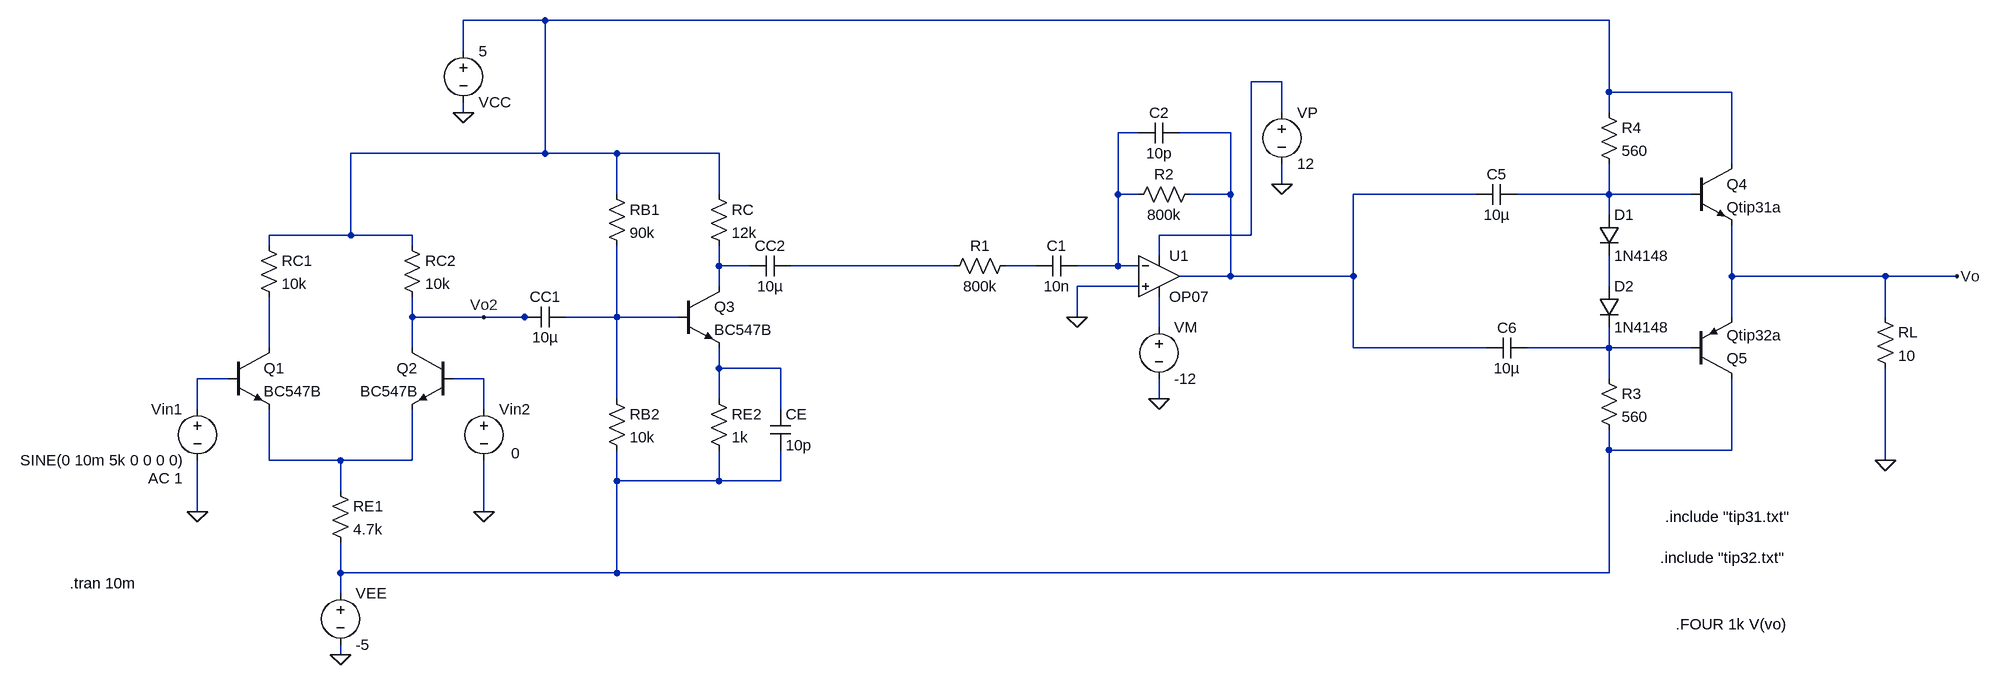
[diagram p0: schematic Complete Circuit.asc]
Complete Circuit.asc, the LTspice schematic file:
Version 4
SHEET 1 3528 680
WIRE 896 -544 768 -544
WIRE 2560 -544 896 -544
WIRE 768 -496 768 -544
WIRE 2048 -448 2000 -448
WIRE 2560 -432 2560 -544
WIRE 2752 -432 2560 -432
WIRE 768 -400 768 -416
WIRE 2048 -400 2048 -448
WIRE 2560 -400 2560 -432
WIRE 1824 -368 1792 -368
WIRE 1968 -368 1888 -368
WIRE 896 -336 896 -544
WIRE 896 -336 592 -336
WIRE 1008 -336 896 -336
WIRE 1168 -336 1008 -336
WIRE 2752 -320 2752 -432
WIRE 2048 -288 2048 -320
WIRE 1008 -272 1008 -336
WIRE 1168 -272 1168 -336
WIRE 1792 -272 1792 -368
WIRE 1824 -272 1792 -272
WIRE 1968 -272 1968 -368
WIRE 1968 -272 1904 -272
WIRE 2352 -272 2160 -272
WIRE 2560 -272 2560 -320
WIRE 2560 -272 2416 -272
WIRE 2688 -272 2560 -272
WIRE 2560 -240 2560 -272
WIRE 592 -208 592 -336
WIRE 592 -208 464 -208
WIRE 688 -208 592 -208
WIRE 2000 -208 2000 -448
WIRE 2000 -208 1856 -208
WIRE 464 -192 464 -208
WIRE 688 -192 688 -208
WIRE 1856 -176 1856 -208
WIRE 1168 -160 1168 -192
WIRE 1216 -160 1168 -160
WIRE 1536 -160 1280 -160
WIRE 1664 -160 1616 -160
WIRE 1792 -160 1792 -272
WIRE 1792 -160 1728 -160
WIRE 1824 -160 1792 -160
WIRE 1968 -144 1968 -272
WIRE 1968 -144 1888 -144
WIRE 2160 -144 2160 -272
WIRE 2160 -144 1968 -144
WIRE 2752 -144 2752 -224
WIRE 2992 -144 2752 -144
WIRE 3104 -144 2992 -144
WIRE 1168 -128 1168 -160
WIRE 1824 -128 1728 -128
WIRE 2560 -128 2560 -176
WIRE 688 -80 688 -112
WIRE 800 -80 688 -80
WIRE 864 -80 800 -80
WIRE 880 -80 864 -80
WIRE 1008 -80 1008 -192
WIRE 1008 -80 928 -80
WIRE 1104 -80 1008 -80
WIRE 1728 -80 1728 -128
WIRE 2752 -80 2752 -144
WIRE 2992 -80 2992 -144
WIRE 1856 -64 1856 -112
WIRE 464 -32 464 -112
WIRE 688 -32 688 -80
WIRE 2160 -32 2160 -144
WIRE 2368 -32 2160 -32
WIRE 2560 -32 2560 -64
WIRE 2560 -32 2432 -32
WIRE 2688 -32 2560 -32
WIRE 1168 0 1168 -32
WIRE 1264 0 1168 0
WIRE 400 16 352 16
WIRE 800 16 752 16
WIRE 2560 16 2560 -32
WIRE 1008 48 1008 -80
WIRE 1168 48 1168 0
WIRE 1856 48 1856 16
WIRE 352 64 352 16
WIRE 800 64 800 16
WIRE 1264 64 1264 0
WIRE 2560 128 2560 96
WIRE 2752 128 2752 16
WIRE 2752 128 2560 128
WIRE 464 144 464 64
WIRE 576 144 464 144
WIRE 688 144 688 64
WIRE 688 144 576 144
WIRE 2992 144 2992 0
WIRE 1008 176 1008 128
WIRE 1168 176 1168 128
WIRE 1168 176 1008 176
WIRE 1264 176 1264 128
WIRE 1264 176 1168 176
WIRE 576 192 576 144
WIRE 352 224 352 144
WIRE 800 224 800 144
WIRE 576 320 576 272
WIRE 1008 320 1008 176
WIRE 1008 320 576 320
WIRE 2560 320 2560 128
WIRE 2560 320 1008 320
WIRE 576 352 576 320
WIRE 576 448 576 432
FLAG 352 224 0
FLAG 800 224 0
FLAG 576 448 0
FLAG 1728 -80 0
FLAG 800 -80 Vo2
FLAG 768 -400 0
FLAG 1856 48 0
FLAG 2048 -288 0
FLAG 2992 144 0
FLAG 3104 -144 Vo
SYMBOL res 448 -208 R0
SYMATTR InstName RC1
SYMATTR Value 10k
SYMBOL res 672 -208 R0
SYMATTR InstName RC2
SYMATTR Value 10k
SYMBOL npn 400 -32 R0
SYMATTR InstName Q1
SYMATTR Value BC547B
SYMBOL npn 752 -32 M0
SYMATTR InstName Q2
SYMATTR Value BC547B
SYMBOL res 560 176 R0
SYMATTR InstName RE1
SYMATTR Value 4.7k
SYMBOL voltage 768 -512 R0
WINDOW 0 24 96 Left 2
WINDOW 3 24 16 Left 2
WINDOW 123 0 0 Left 0
WINDOW 39 0 0 Left 0
SYMATTR InstName VCC
SYMATTR Value 5
SYMBOL voltage 800 48 R0
WINDOW 123 0 0 Left 0
WINDOW 39 0 0 Left 0
WINDOW 3 43 85 Left 2
SYMATTR Value 0
SYMATTR InstName Vin2
SYMBOL voltage 352 48 M0
WINDOW 123 24 124 Left 2
WINDOW 39 0 0 Left 0
SYMATTR Value2 AC 1
SYMATTR InstName Vin1
SYMATTR Value SINE(0 10m 5k 0 0 0 0)
SYMBOL voltage 576 336 R0
WINDOW 123 0 0 Left 0
WINDOW 39 0 0 Left 0
SYMATTR InstName VEE
SYMATTR Value -5
SYMBOL npn 1104 -128 R0
SYMATTR InstName Q3
SYMATTR Value BC547B
SYMBOL res 1152 -288 R0
SYMATTR InstName RC
SYMATTR Value 12k
SYMBOL res 1152 32 R0
SYMATTR InstName RE2
SYMATTR Value 1k
SYMBOL res 992 -288 R0
SYMATTR InstName RB1
SYMATTR Value 90k
SYMBOL res 992 32 R0
SYMATTR InstName RB2
SYMATTR Value 10k
SYMBOL cap 928 -96 R90
WINDOW 0 0 32 VBottom 2
WINDOW 3 32 32 VTop 2
SYMATTR InstName CC1
SYMATTR Value 10µ
SYMBOL cap 1280 -176 R90
WINDOW 0 0 32 VBottom 2
WINDOW 3 32 32 VTop 2
SYMATTR InstName CC2
SYMATTR Value 10µ
SYMBOL cap 1248 64 R0
SYMATTR InstName CE
SYMATTR Value 10p
SYMBOL res 1920 -288 R90
WINDOW 0 0 56 VBottom 2
WINDOW 3 32 56 VTop 2
SYMATTR InstName R2
SYMATTR Value 800k
SYMBOL res 1632 -176 R90
WINDOW 0 0 56 VBottom 2
WINDOW 3 32 56 VTop 2
SYMATTR InstName R1
SYMATTR Value 800k
SYMBOL cap 1888 -384 R90
WINDOW 0 0 32 VBottom 2
WINDOW 3 32 32 VTop 2
SYMATTR InstName C2
SYMATTR Value 10p
SYMBOL cap 1728 -176 R90
WINDOW 0 0 32 VBottom 2
WINDOW 3 32 32 VTop 2
SYMATTR InstName C1
SYMATTR Value 10n
SYMBOL voltage 2048 -416 R0
WINDOW 123 0 0 Left 0
WINDOW 39 0 0 Left 0
SYMATTR InstName VP
SYMATTR Value 12
SYMBOL voltage 1856 -80 R0
WINDOW 123 0 0 Left 0
WINDOW 39 0 0 Left 0
SYMATTR InstName VM
SYMATTR Value -12
SYMBOL npn 2688 -320 R0
SYMATTR InstName Q4
SYMATTR Value Qtip31a
SYMBOL pnp 2688 16 M180
SYMATTR InstName Q5
SYMATTR Value Qtip32a
SYMBOL res 2544 -416 R0
SYMATTR InstName R4
SYMATTR Value 560
SYMBOL res 2544 0 R0
SYMATTR InstName R3
SYMATTR Value 560
SYMBOL res 2976 -96 R0
SYMATTR InstName RL
SYMATTR Value 10
SYMBOL diode 2544 -240 R0
SYMATTR InstName D1
SYMATTR Value 1N4148
SYMBOL diode 2544 -128 R0
SYMATTR InstName D2
SYMATTR Value 1N4148
SYMBOL cap 2416 -288 R90
WINDOW 0 0 32 VBottom 2
WINDOW 3 32 32 VTop 2
SYMATTR InstName C5
SYMATTR Value 10µ
SYMBOL cap 2432 -48 R90
WINDOW 0 0 32 VBottom 2
WINDOW 3 32 32 VTop 2
SYMATTR InstName C6
SYMATTR Value 10µ
SYMBOL OpAmps\\OP07 1856 -208 R0
SYMATTR InstName U1
TEXT 152 336 Left 2 !.tran 10m
TEXT 2648 232 Left 2 !.include "tip31.txt"
TEXT 2640 296 Left 2 !.include "tip32.txt"
TEXT 2664 400 Left 2 !.FOUR 1k V(vo)

The netlist it stands for:
* Complete Circuit.asc
RC1 N001 N012 10k
RC2 N001 Vo2 10k
Q1 N012 N015 N018 0 BC547B
Q2 Vo2 N016 N018 0 BC547B
RE1 N018 N017 4.7k
VCC N001 0 5
Vin2 N016 0 0
Vin1 N015 0 SINE(0 10m 5k 0 0 0 0) AC 1
VEE N017 0 -5
Q3 N006 N010 N014 0 BC547B
RC N001 N006 12k
RE2 N014 N017 1k
RB1 N001 N010 90k
RB2 N010 N017 10k
CC1 N010 Vo2 10µ
CC2 N007 N006 10µ
CE N014 N017 10p
R2 N004 N003 800k
R1 N008 N007 800k
C2 N004 N003 10p
C1 N003 N008 10n
VP N002 0 12
VM N011 0 -12
Q4 N001 N005 Vo 0 Qtip31a
Q5 N017 N013 Vo 0 Qtip32a
R4 N001 N005 560
R3 N013 N017 560
RL Vo 0 10
D1 N005 N009 1N4148
D2 N009 N013 1N4148
C5 N005 N004 10µ
C6 N013 N004 10µ
XU1 0 N003 N002 N011 N004 LT1001  ; OP07, pins In+ In- V+ V- OUT
.model D D
.lib standard.dio
.model NPN NPN
.model PNP PNP
.lib standard.bjt
.tran 10m
.include "tip31.txt"
.include "tip32.txt"
.FOUR 1k V(vo)
.lib LTC.lib
.backanno
.end